# Altium schematic sheet BOT-TOP.SchDoc
size A
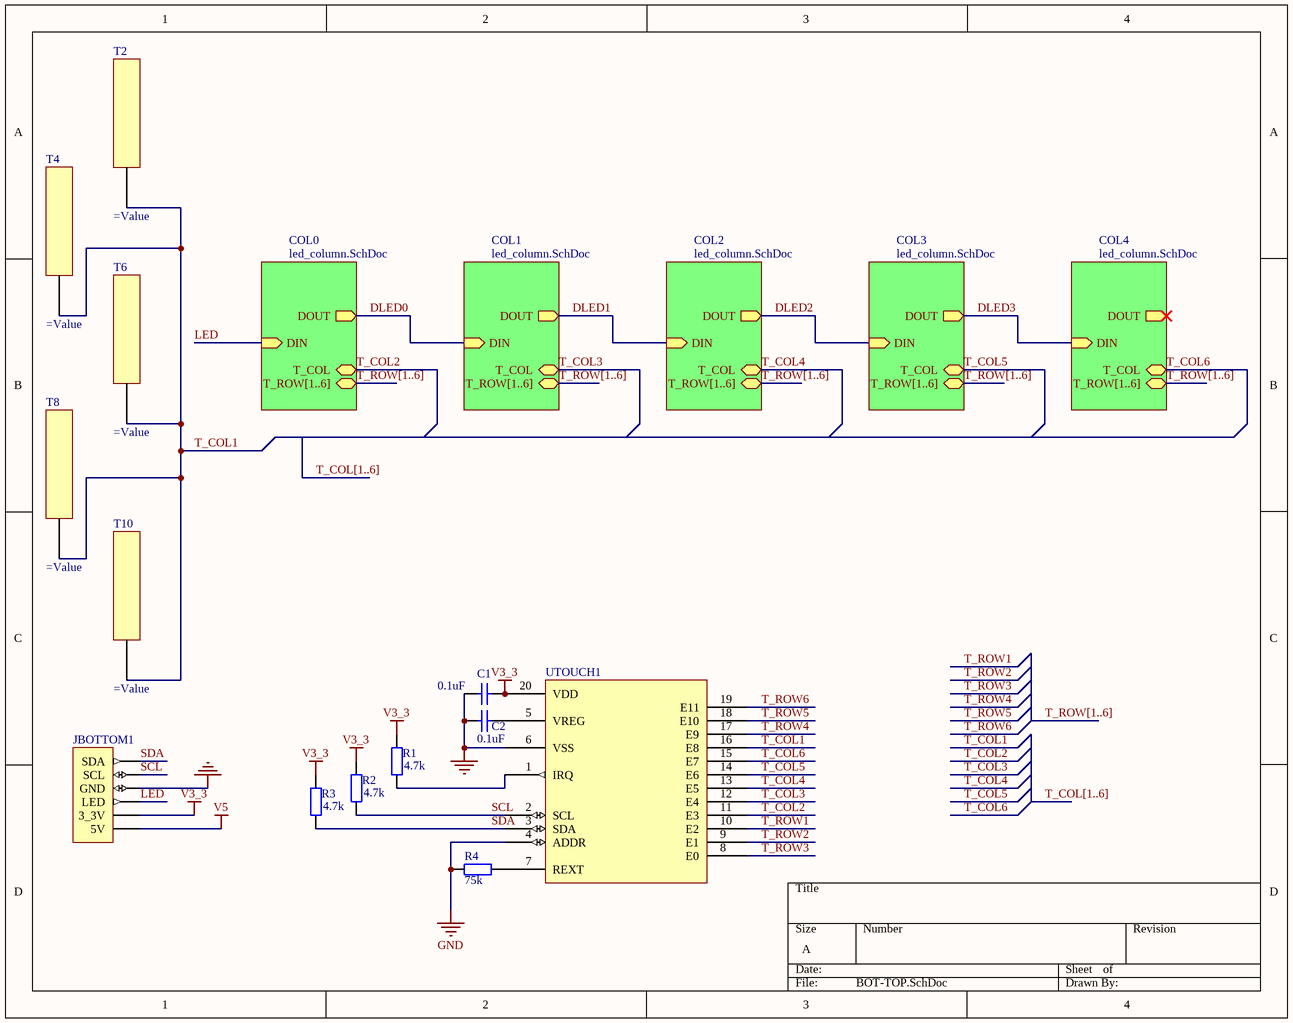
[diagram p0: BOT-TOP.SchDoc]

## Parts
C1  0.1uF  [CAPC2012L]
C2  0.1uF  [CAPC2012L]
JBOTTOM1  (no value)  [HDR1X6]
R1  4.7k  [RESC2012L]
R2  4.7k  [RESC2012L]
R3  4.7k  [RESC2012L]
R4  75k  [RESC2012L]
T2  (no value)  [TouchStrip_Vert]
T4  (no value)  [TouchStrip_Vert]
T6  (no value)  [TouchStrip_Vert]
T8  (no value)  [TouchStrip_Vert]
T10  (no value)  [TouchStrip_Vert]
UTOUCH1  (no value)  [MPR121]

## Sub-sheets
COL0 = led_column.SchDoc: DOUT (out), DIN (in), T_COL (bidir), T_ROW[1..6] (bidir)
COL1 = led_column.SchDoc: DOUT (out), DIN (in), T_COL (bidir), T_ROW[1..6] (bidir)
COL2 = led_column.SchDoc: DOUT (out), DIN (in), T_COL (bidir), T_ROW[1..6] (bidir)
COL3 = led_column.SchDoc: DOUT (out), DIN (in), T_COL (bidir), T_ROW[1..6] (bidir)
COL4 = led_column.SchDoc: DOUT (out), DIN (in), T_COL (bidir), T_ROW[1..6] (bidir)

## Nets
GND: C1.1 C2.1 JBOTTOM1.4(GND) R4.1 UTOUCH1.4(ADDR) UTOUCH1.6(VSS)
V3_3: C1.2 JBOTTOM1.2(3_3V) R1.1 R2.1 R3.1 UTOUCH1.20(VDD)
V5: JBOTTOM1.1(5V)
DLED0: sheet COL0/DOUT, sheet COL1/DIN
DLED1: sheet COL1/DOUT, sheet COL2/DIN
DLED2: sheet COL2/DOUT, sheet COL3/DIN
DLED3: sheet COL3/DOUT, sheet COL4/DIN
LED: JBOTTOM1.3(LED) ; sheet COL0/DIN
SCL: JBOTTOM1.5(SCL) R2.2 UTOUCH1.2(SCL)
SDA: JBOTTOM1.6(SDA) R3.2 UTOUCH1.3(SDA)
T_COL1: T2.0 T4.0 T6.0 T8.0 T10.0 UTOUCH1.16(E8)
T_COL2: UTOUCH1.11(E3) ; sheet COL0/T_COL
T_COL3: UTOUCH1.12(E4) ; sheet COL1/T_COL
T_COL4: UTOUCH1.13(E5) ; sheet COL2/T_COL
T_COL5: UTOUCH1.14(E6) ; sheet COL3/T_COL
T_COL6: UTOUCH1.15(E7) ; sheet COL4/T_COL
T_ROW1: UTOUCH1.10(E2)
T_ROW2: UTOUCH1.9(E1)
T_ROW3: UTOUCH1.8(E0)
T_ROW4: UTOUCH1.17(E9)
T_ROW5: UTOUCH1.18(E10)
T_ROW6: UTOUCH1.19(E11)
NetC2_2: C2.2 UTOUCH1.5(VREG)
NetR1_2: R1.2 UTOUCH1.1(IRQ)
NetR4_2: R4.2 UTOUCH1.7(REXT)

## Buses and harness runs
bus T_COL[1..6]
bus T_ROW[1..6]
bus T_ROW[1..6] = sheet COL0/T_ROW[1..6]
bus T_ROW[1..6] = sheet COL1/T_ROW[1..6]
bus T_ROW[1..6] = sheet COL2/T_ROW[1..6]
bus T_ROW[1..6] = sheet COL3/T_ROW[1..6]
bus T_ROW[1..6] = sheet COL4/T_ROW[1..6]

## Library data of the parts
C1 C2 = Cap: Capacitor; Published: 8-Jun-2000; LatestRevisionDate: 17-Jul-2002; LatestRevisionNote: Re-released for DXP Platform.; PackageReference: RAD-0.3; Publisher: Altium Limited; PackageDescription: Radial Cap, Thru-Hole; 2 Leads; 0.3 in Pin Spacing; Value: 0.1uF
JBOTTOM1 = Header 6: Header, 6-Pin; LatestRevisionDate: 17-Jul-2002; LatestRevisionNote: Re-released for DXP Platform.; Publisher: Altium Limited
R1-R4 = Res2: Resistor; Published: 8-Jun-2000; LatestRevisionDate: 17-Jul-2002; LatestRevisionNote: Re-released for DXP Platform.; PackageReference: AXIAL-0.4; Publisher: Altium Limited
  R1-R3: Value: 4.7k
  R4: Value: 75k
T2 T4 T6 T8 T10 = TouchStrip
UTOUCH1 = MPR121